# Altium schematic sheet Sheet_1_2022-01-05.schdoc
size 57 x 37 mm
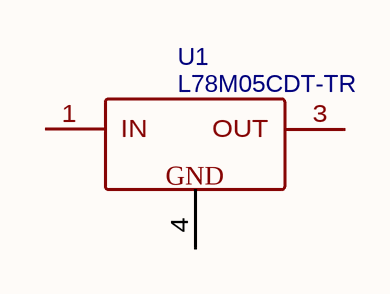
[diagram p0: Sheet_1_2022-01-05.schdoc]

## Parts
U1  L78M05CDT-TR  [TO-252-2_L6.5-W6.1-P4.58-LS10.0-TL]

## Nets

Not connected (* = marked no-connect by the designer): U1 1(IN) 3(OUT) 4(GND)

## Library data of the parts
U1 = L78M05CDT-TR: BOM_Manufacturer: STMicroelectronics; BOM_Supplier: LCSC; BOM_Manufacturer Part: L78M05CDT-TR; BOM_Supplier Part: C55509; BOM_JLCPCB Part Class: Extended Part; spicePre: U; spiceSymbolName: L78M05CDT-TR